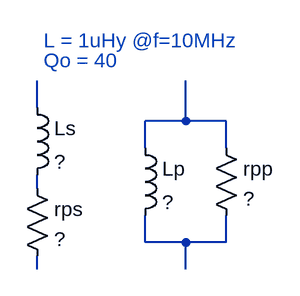
[diagram p0: schematic inductor.asc]
inductor.asc, the LTspice schematic file:
Version 4
SHEET 1 880 680
WIRE 16 96 16 64
WIRE 192 112 192 64
WIRE 192 112 144 112
WIRE 240 112 192 112
WIRE 144 144 144 112
WIRE 240 144 240 112
WIRE 16 192 16 176
WIRE 144 256 144 224
WIRE 192 256 144 256
WIRE 240 256 240 224
WIRE 240 256 192 256
WIRE 16 288 16 272
WIRE 192 288 192 256
SYMBOL ind 0 80 R0
SYMATTR InstName Ls
SYMATTR Value ?
SYMBOL res 0 176 R0
SYMATTR InstName rps
SYMATTR Value ?
SYMBOL ind 128 128 R0
SYMATTR InstName Lp
SYMATTR Value ?
SYMBOL res 224 128 R0
SYMATTR InstName rpp
SYMATTR Value ?
TEXT 24 40 Left 2 ;Qo = 40
TEXT 24 16 Left 2 ;L = 1uHy @f=10MHz

The netlist it stands for:
* inductor.asc
Ls N001 N003 ?
rps N003 N005 ?
Lp N002 N004 ?
rpp N002 N004 ?
* Qo = 40
* L = 1uHy @f=10MHz
.backanno
.end